# EAGLE design six2two-switch3-interlock (EAGLE 6.4)
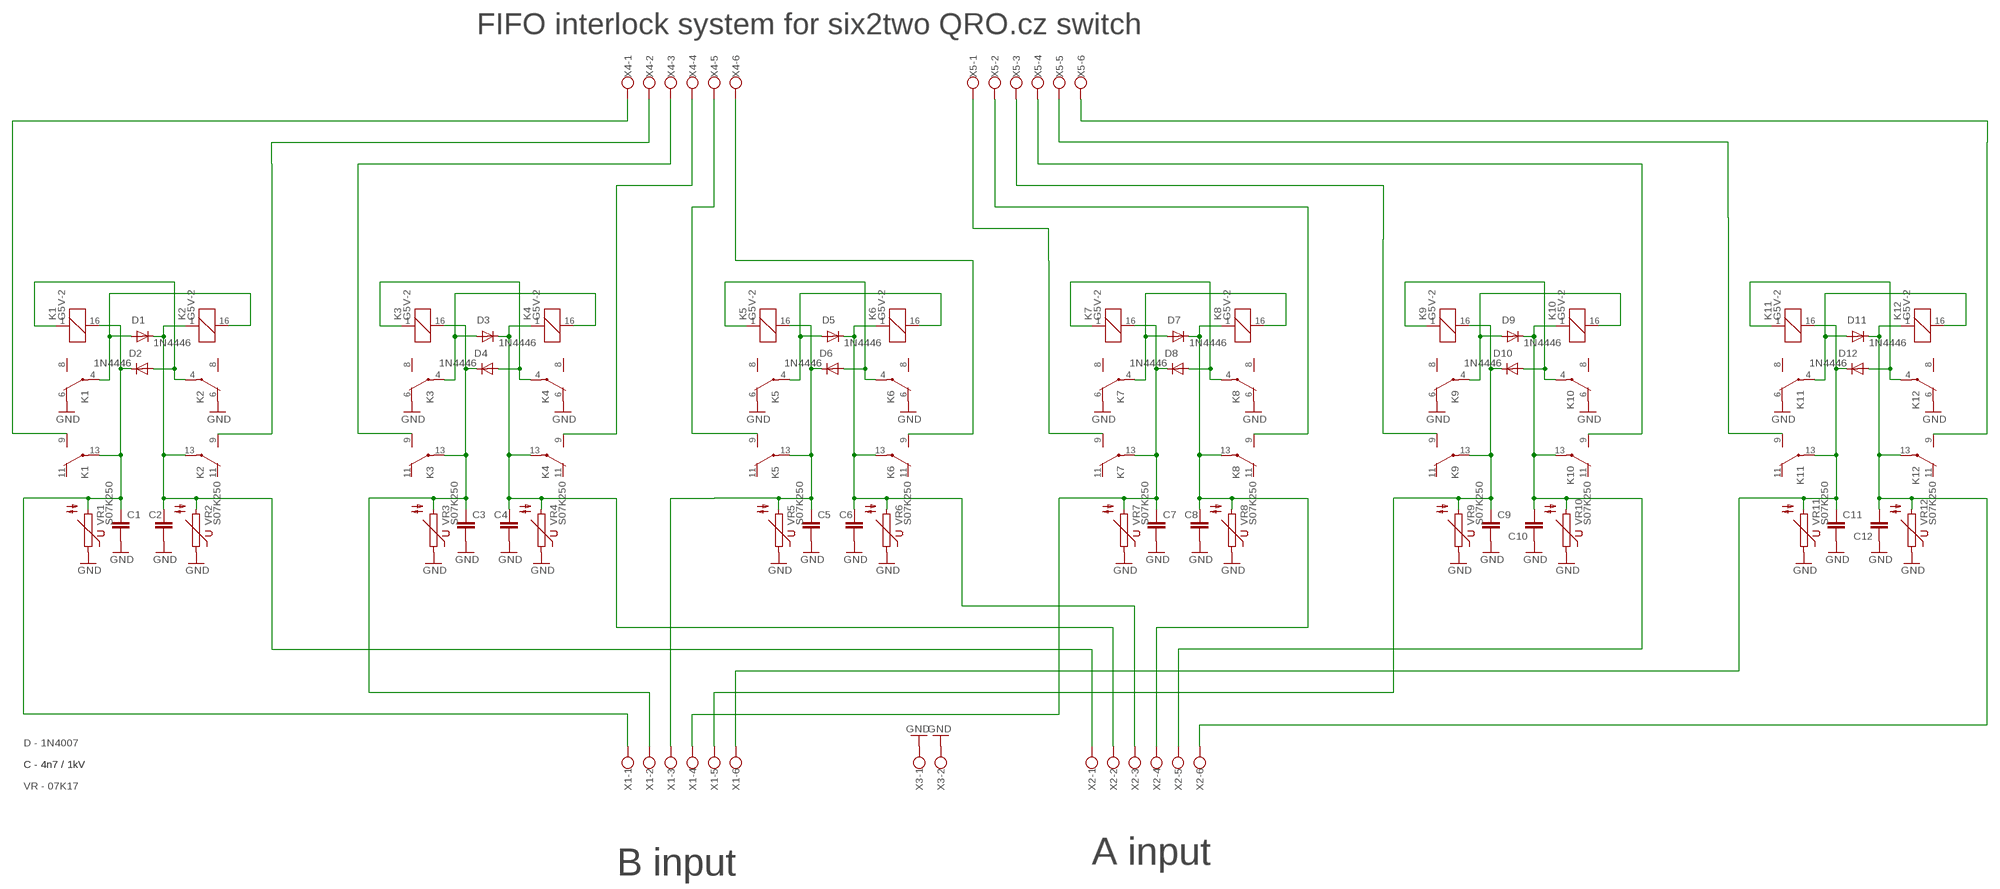
[diagram p0: schematic, sheet 1]

## Parts
C1  C-EU050-024X044  [C050-024X044]
C2  C-EU050-024X044  [C050-024X044]
C3  C-EU050-024X044  [C050-024X044]
C4  C-EU050-024X044  [C050-024X044]
C5  C-EU050-024X044  [C050-024X044]
C6  C-EU050-024X044  [C050-024X044]
C7  C-EU050-024X044  [C050-024X044]
C8  C-EU050-024X044  [C050-024X044]
C9  C-EU050-024X044  [C050-024X044]
C10  C-EU050-024X044  [C050-024X044]
C11  C-EU050-024X044  [C050-024X044]
C12  C-EU050-024X044  [C050-024X044]
D1  1N4446  [DO35-10]
D2  1N4446  [DO35-10]
D3  1N4446  [DO35-10]
D4  1N4446  [DO35-10]
D5  1N4446  [DO35-10]
D6  1N4446  [DO35-10]
D7  1N4446  [DO35-10]
D8  1N4446  [DO35-10]
D9  1N4446  [DO35-10]
D10  1N4446  [DO35-10]
D11  1N4446  [DO35-10]
D12  1N4446  [DO35-10]
K1  G5V-2  [G5V-2]
K2  G5V-2  [G5V-2]
K3  G5V-2  [G5V-2]
K4  G5V-2  [G5V-2]
K5  G5V-2  [G5V-2]
K6  G5V-2  [G5V-2]
K7  G5V-2  [G5V-2]
K8  G5V-2  [G5V-2]
K9  G5V-2  [G5V-2]
K10  G5V-2  [G5V-2]
K11  G5V-2  [G5V-2]
K12  G5V-2  [G5V-2]
VR1  S07K250  [S07K250]
VR2  S07K250  [S07K250]
VR3  S07K250  [S07K250]
VR4  S07K250  [S07K250]
VR5  S07K250  [S07K250]
VR6  S07K250  [S07K250]
VR7  S07K250  [S07K250]
VR8  S07K250  [S07K250]
VR9  S07K250  [S07K250]
VR10  S07K250  [S07K250]
VR11  S07K250  [S07K250]
VR12  S07K250  [S07K250]
X1  W237-136  [W237-136]
X2  W237-136  [W237-136]
X3  W237-102  [W237-102]
X4  W237-136  [W237-136]
X5  W237-136  [W237-136]

## Nets
GND: C1.2 C2.2 C3.2 C4.2 C5.2 C6.2 C7.2 C8.2 C9.2 C10.2 C11.2 C12.2 K1.6(1:O) K2.6(1:O) K3.6(1:O) K4.6(1:O) K5.6(1:O) K6.6(1:O) K7.6(1:O) K8.6(1:O) K9.6(1:O) K10.6(1:O) K11.6(1:O) K12.6(1:O) VR1.1 VR2.1 VR3.1 VR4.1 VR5.1 VR6.1 VR7.1 VR8.1 VR9.1 VR10.1 VR11.1 VR12.1 X3.1 X3.2
N$1: K3.9(2:S) X4.3
N$2: K1.9(2:S) X4.1
N$3: C1.1 D2.C K1.13(2:P) K1.16 VR1.2 X1.1
N$4: C2.1 D1.C K2.1 K2.13(2:P) VR2.2 X2.1
N$5: D1.A K1.4(1:P) K2.16
N$6: D2.A K1.1 K2.4(1:P)
N$7: K2.9(2:S) X4.2
N$8: C3.1 D4.C K3.13(2:P) K3.16 VR3.2 X1.2
N$9: C4.1 D3.C K4.1 K4.13(2:P) VR4.2 X2.2
N$10: D3.A K3.4(1:P) K4.16
N$11: D4.A K3.1 K4.4(1:P)
N$12: K4.9(2:S) X4.4
N$13: K5.9(2:S) X4.5
N$14: C5.1 D6.C K5.13(2:P) K5.16 VR5.2 X1.3
N$15: C6.1 D5.C K6.1 K6.13(2:P) VR6.2 X2.3
N$16: D5.A K5.4(1:P) K6.16
N$17: D6.A K5.1 K6.4(1:P)
N$18: K6.9(2:S) X4.6
N$19: K7.9(2:S) X5.1
N$20: C7.1 D8.C K7.13(2:P) K7.16 VR7.2 X1.4
N$21: C8.1 D7.C K8.1 K8.13(2:P) VR8.2 X2.4
N$22: D7.A K7.4(1:P) K8.16
N$23: D8.A K7.1 K8.4(1:P)
N$24: K8.9(2:S) X5.2
N$25: K9.9(2:S) X5.3
N$26: C9.1 D10.C K9.13(2:P) K9.16 VR9.2 X1.5
N$27: C10.1 D9.C K10.1 K10.13(2:P) VR10.2 X2.5
N$28: D9.A K9.4(1:P) K10.16
N$29: D10.A K9.1 K10.4(1:P)
N$30: K10.9(2:S) X5.4
N$31: K11.9(2:S) X5.5
N$32: C11.1 D12.C K11.13(2:P) K11.16 VR11.2 X1.6
N$33: C12.1 D11.C K12.1 K12.13(2:P) VR12.2 X2.6
N$34: D11.A K11.4(1:P) K12.16
N$35: D12.A K11.1 K12.4(1:P)
N$36: K12.9(2:S) X5.6
Unconnected: K1.8(1:S) K1.11(2:O) K2.8(1:S) K2.11(2:O) K3.8(1:S) K3.11(2:O) K4.8(1:S) K4.11(2:O) K5.8(1:S) K5.11(2:O) K6.8(1:S) K6.11(2:O) K7.8(1:S) K7.11(2:O) K8.8(1:S) K8.11(2:O) K9.8(1:S) K9.11(2:O) K10.8(1:S) K10.11(2:O) K11.8(1:S) K11.11(2:O) K12.8(1:S) K12.11(2:O)

## Notes on the sheet
- FIFO interlock system for six2two QRO.cz switch
- D - 1N4007
- C - 4n7 / 1kV | C - 4n7 / 1kV
- VR - 07K17
- B input | A input

## Library data of the parts
C1-C12 = rcl2:C-EU: CAPACITOR, European symbol
D1-D12 = diode:1N4446: DIODE high speed (Philips)
K1-K12 = relay:G5V-2: OMRON PCB Relay Source: http://www.omron.com/ecb/products/pdf/en-g5v2.pdf; MPN: G5V-2 5DC; OC_FARNELL: 9949488; OC_NEWARK: 78K5703
VR1-VR12 = varistor:S07K250: VARISTOR
X1 X2 X4 X5 = con-wago-500:W237-136: WAGO SCREW CLAMP; MPN: 237-136; OC_FARNELL: unknown; OC_NEWARK: 84K9151
X3 = con-wago-500:W237-102: WAGO SCREW CLAMP; MPN: 237-102; OC_FARNELL: unknown; OC_NEWARK: 70K9898

## Board
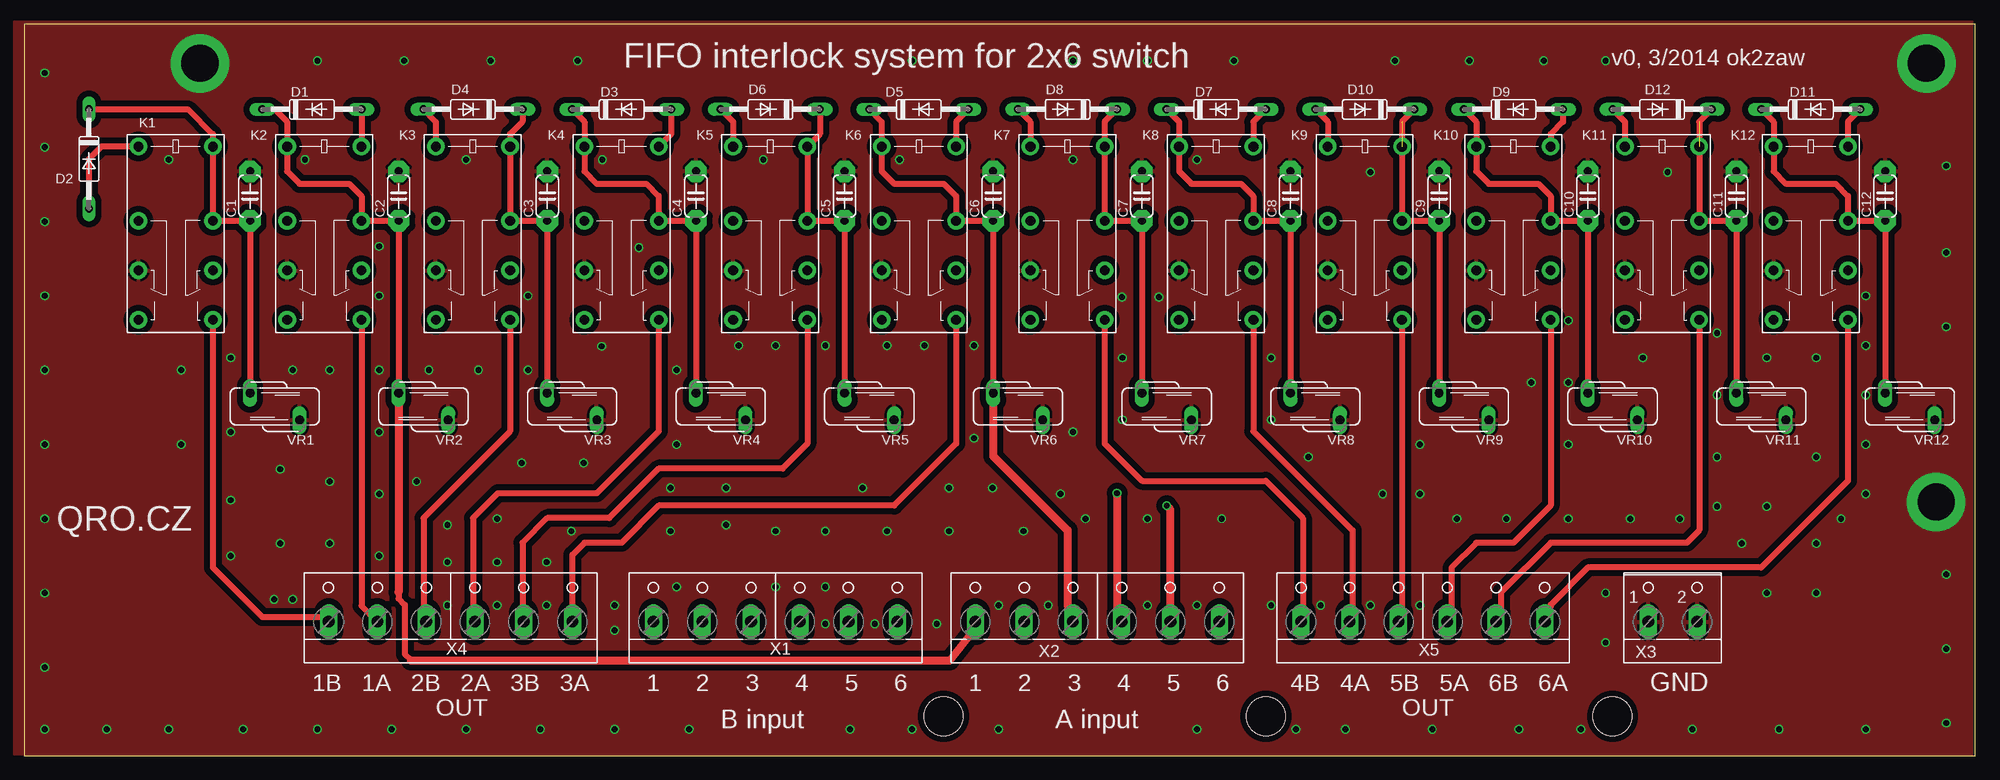
[diagram p1: board, top side]
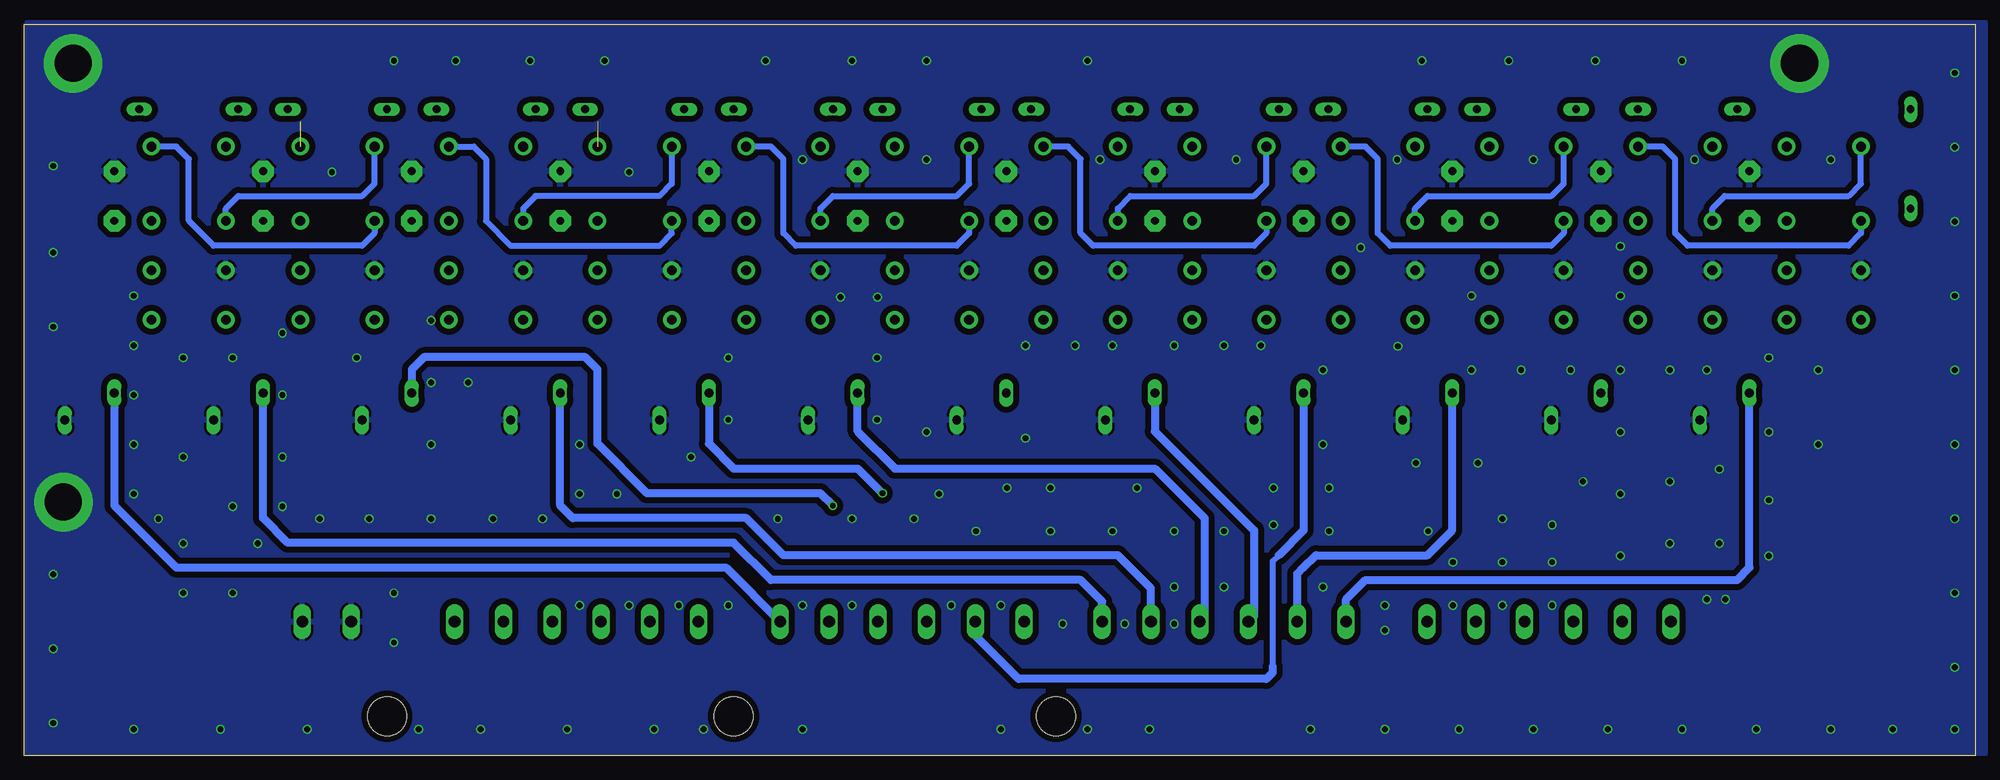
[diagram p2: board, bottom side, seen from below]

Size 200 x 75 mm. Coordinates in mm from the lower left corner, seen from the top.
Outline: 0,0 200,0 200,75 0,75 0,0
Copper layers (1*16): Top 0.035mm / dielectric 1.5mm / Bottom 0.035mm
Design rules "Fusion_eagle_rule_v1.1 *": minimum track width 6mil, minimum drill 12mil, track to track 6mil, track to pad 6mil, pad to pad 6mil, via to via 6mil, smd to smd 0mil, copper to edge 0mil, drill to drill 10mil, minimum pad ring 10mil, minimum via ring 6mil, stop-mask expansion 2mil, vias tented up to drill 100mil, thermal gap 10mil
Holes 4 mm at 94.25,4.05 127.27,4.05 162.83,4.05

### Footprints (pad centres in the part's own frame; a part is rotated, then mirrored left to right if it is on the bottom)
C050-024X044 = drill 0.813 pad 2.184 octagon: 1 -2.54,0; 2 2.54,0
DO35-10 = drill 0.813 long: A 5.08,0; C -5.08,0
G5V-2 = drill 1 pad 1.8: 1 -8.89,-3.81; 4 -1.27,-3.81; 6 3.81,-3.81; 8 8.89,-3.81; 9 8.89,3.81; 11 3.81,3.81; 13 -1.27,3.81; 16 -8.89,3.81
S07K250 = drill 0.914 long: 1 -1.397,-2.54; 2 1.397,2.54
W237-136 = drill 1.194 long: 1 -12.5,-1.27; 2 -7.5,-1.27; 3 -2.5,-1.27; 4 2.5,-1.27; 5 7.5,-1.27; 6 12.5,-1.27
W237-102 = drill 1.194 long: 1 -2.5,-1.27; 2 2.5,-1.27

### Placement (x,y rotation side)
C1  23.13,57.39 90 top
C2  38.37,57.39 90 top
C3  53.61,57.39 90 top
C4  68.85,57.39 90 top
C5  84.09,57.39 90 top
C6  99.33,57.39 90 top
C7  114.57,57.39 90 top
C8  129.81,57.39 90 top
C9  145.05,57.39 90 top
C10  160.29,57.39 90 top
C11  175.53,57.39 90 top
C12  190.77,57.39 90 top
D1  29.48,66.28 0 top
D2  6.62,61.2 270 top
D3  61.23,66.28 0 top
D4  45.99,66.28 180 top
D5  91.71,66.28 0 top
D6  76.47,66.28 180 top
D7  122.19,66.28 0 top
D8  106.95,66.28 180 top
D9  152.67,66.28 0 top
D10  137.43,66.28 180 top
D11  183.15,66.28 0 top
D12  167.91,66.28 180 top
K1  15.51,53.58 270 top
K2  30.75,53.58 270 top
K3  45.99,53.58 270 top
K4  61.23,53.58 270 top
K5  76.47,53.58 270 top
K6  91.71,53.58 270 top
K7  106.95,53.58 270 top
K8  122.19,53.58 270 top
K9  137.43,53.58 270 top
K10  152.67,53.58 270 top
K11  167.91,53.58 270 top
K12  183.15,53.58 270 top
VR1  25.67,35.8 90 top
VR2  40.91,35.8 90 top
VR3  56.15,35.8 90 top
VR4  71.39,35.8 90 top
VR5  86.63,35.8 90 top
VR6  101.87,35.8 90 top
VR7  117.11,35.8 90 top
VR8  132.35,35.8 90 top
VR9  147.59,35.8 90 top
VR10  162.83,35.8 90 top
VR11  178.07,35.8 90 top
VR12  193.31,35.8 90 top
X1  77,15 0 top
X2  110,15 0 top
X3  169,15 0 top
X4  43.69,15 0 top
X5  143.39,15 0 top

### Tracks (layer width: path | path; a pad name or v marks a point on that pad's centre or on a via)
GND  (via drill 0.6, 3.8 pad 6)
  other vias: 18,71 196,26 195,71 51.63,47.15 82.11,42.07 88.46,42.07 92.27,42.07 73.22,42.07 77.03,42.07 159.58,2.7 153.23,2.7 144.34,2.7 135.45,2.7 130.37,2.7 120.21,2.7 99.89,2.7 91,2.7 84.65,2.7 68.14,2.7 60.52,2.7 52.9,2.7 45.28,2.7 37.66,2.7 30.04,2.7 22.42,2.7 14.8,2.7 8.45,2.7 2.1,2.7 2.1,9.05 2.1,16.67 2.1,24.29 2.1,31.91 2.1,39.53 2.1,47.15 2.1,54.77 2.1,62.39 2.1,70.01 16.07,39.53 16.07,31.91 30.04,71.28 38.93,71.28 47.82,71.28 56.71,71.28 91,71.28 107.51,71.28 115.13,71.28 124.02,71.28 140.53,71.28 148.15,71.28 155.77,71.28 162.12,71.28 112.53,47.03 116.34,47.03 63,52.11 197.04,3.34 197.04,10.96 197.04,18.58 197.04,43.98 197.04,51.6 197.04,60.49 59.19,41.98 26.23,21.75 31.31,21.75 31.31,28.1 31.31,39.53 27.5,39.53 26.23,29.37 27.5,16.04 25.59,16.04 21.15,20.48 21.15,26.2 21.15,33.18 21.15,40.8 41.47,39.53 46.55,39.53 40.2,28.1 36.39,20.48 36.39,26.83 36.39,33.18 36.39,39.53 36.39,47.15 36.39,52.23 60.52,15.4 60.52,12.86 53.53,15.4 48.45,15.4 43.37,15.4 66.87,17.31 77.03,17.31 77.03,23.02 71.95,23.66 66.23,23.02 66.23,27.47 71.95,27.47 66.87,31.91 66.87,39.53 53.53,19.85 48.45,19.85 43.37,19.85 43.37,23.66 48.45,24.29 50.99,30.01 57.34,30.01 51.63,39.53 82.11,17.31 82.11,23.02 85.92,27.47 94.81,27.47 99.25,27.47 97.35,32.55 97.35,42.07 93.54,13.5 87.19,13.5 82.11,13.5 171.01,2.7 179.9,2.7 188.79,2.7 122.75,24.29 115.13,24.29 108.78,24.29 106.24,26.83 102.43,23.02 94.81,23.02 88.46,23.02 139.26,26.83 143.07,26.83 143.07,31.91 131.64,30.64 127.83,34.45 127.83,40.8 112.59,40.8 112.59,34.45 107.51,33.18 146.88,24.29 151.96,24.29 154.5,38.26 158.31,38.26 158.31,44.61 158.31,31.91 158.31,24.29 164.66,24.29 169.74,24.29 173.55,25.56 173.55,30.64 173.55,36.99 173.55,43.34 176.09,21.75 183.71,21.75 186.25,24.29 188.79,26.83 188.79,31.91 188.79,36.99 188.79,42.07 178.63,25.56 183.71,30.64 183.71,40.8 178.63,40.8 165.93,40.8 168.47,59.85 137.99,59.85 120.21,61.12 107.51,61.12 89.73,61.12 75.76,61.12 59.25,61.12 45.28,61.12 28.77,61.12 14.8,61.12 127.83,15.4 104.97,15.4 99.89,15.4 115.13,15.4 120.21,15.4 132.91,15.4 137.99,15.4 143.07,15.4 162.12,16.67 162.12,11.59 178.63,16.67 183.71,16.67 188.79,47.15 56.07,23.02
  pour Top (isolate 0.61): -1,75.17 -1,0.24 199.66,0.24 199.66,75.17
  pour Bottom (isolate 0.61): -1,75.17 -1,0.24 199.66,0.24 199.66,75.17
N$1
  Top 0.61: K3.9 49.8,33.26 40.91,24.37 40.91,14.01 X4.3
N$2
  Top 0.61: K1.9 19.32,19.29 24.4,14.21 30.71,14.21 X4.1
N$3
  Top 0.61: D2.C 16.78,66.28 19.32,63.74 K1.16 K1.13 C1.1 VR1.2
  Bottom 0.813: X1.1 64.5,16.02 62.5,18.02 24.4,18.02 23.13,19.29 23.13,37.07 VR1.2
N$4
  Top 0.61: D1.C 25.67,66.28 26.94,65.01 K2.1 26.94,59.93 28.21,58.66 33.29,58.66 34.56,57.39 K2.13 C2.1 VR2.2 | 38.37,16.75 38.37,16.11 39.01,15.48 39.01,10.4 39.64,9.77
  Top 0.813: VR2.2 38.37,16.75 | 39.64,9.77 94.89,9.77 97.42,12.94 97.42,14.29 X2.1
N$5
  Top 0.61: D1.A K2.16
  Bottom 0.61: K1.4 11.7,53.58 12.97,52.31 29.48,52.31 30.75,53.58 30.75,61.2 32.02,62.47 K2.16
N$6
  Top 0.61: K1.1 7.89,62.47 6.62,61.2 D2.A
  Bottom 0.61: K2.4 26.94,56.12 25.67,57.39 12.97,57.39 11.7,58.66 K1.1
N$7
  Top 0.61: K2.9 34.56,15.36 X4.2
N$8
  Top 0.61: D4.C 51.07,65.01 49.8,63.74 K3.16 K3.13 C3.1 VR3.2
  Bottom 0.813: X1.2 69.5,18.64 68.85,19.29 67.58,20.56 56.15,20.56 53.61,23.1 VR3.2
N$9
  Top 0.61: D3.C 57.42,65.01 K4.1 57.42,59.93 58.69,58.66 63.77,58.66 65.04,57.39 K4.13 C4.1 VR4.2
  Bottom 0.61: 71.39,20.56 72.03,19.92 72.03,9.13
  Bottom 0.813: VR4.2 68.85,23.1 71.39,20.56 | 72.03,9.13 72.03,8.5 72.66,7.86 98.06,7.86 102.5,12.3 102.5,13.09 X2.2
N$10
  Top 0.61: D3.A 66.31,63.74 K4.16
  Bottom 0.61: K3.4 42.18,53.58 43.45,52.31 59.96,52.31 61.23,53.58 61.23,61.2 62.5,62.47 K4.16
N$11
  Top 0.61: D4.A 42.18,65.01 K3.1
  Bottom 0.61: K4.4 57.42,56.12 56.15,57.39 43.45,57.39 42.18,58.66 K3.1
N$12
  Top 0.61: K4.9 65.04,33.26 58.69,26.91 48.53,26.91 45.99,24.37 45.99,13.93 X4.4
N$13
  Top 0.61: K5.9 80.28,31.99 77.74,29.45 65.04,29.45 59.96,24.37 53.61,24.37 51.07,21.83 51.07,14.21 51.07,13.85 X4.5
N$14
  Top 0.61: D6.C 81.55,63.74 K5.16 K5.13 C5.1 VR5.2
  Bottom 0.813: VR5.2 84.09,33.26 73.93,23.1 73.93,14.3 X1.3
N$15
  Top 0.61: D5.C 87.9,65.01 K6.1 87.9,59.93 89.17,58.66 94.25,58.66 95.52,57.39 K6.13 C6.1 VR6.2
  Top 0.813: VR6.2 99.33,30.72 106.95,23.1 106.95,15.48 107.58,13.57 107.34,13.57 X2.3
N$16
  Top 0.61: D5.A 95.52,65.01 K6.16
  Bottom 0.61: K5.4 72.66,53.58 73.93,52.31 90.44,52.31 91.71,53.58 91.71,61.2 92.98,62.47 K6.16
N$17
  Top 0.61: D6.A 72.66,65.01 K5.1
  Bottom 0.61: K6.4 87.9,56.12 86.63,57.39 73.93,57.39 72.66,58.66 K5.1
N$18
  Top 0.61: X4.6 56.19,20.6 57.42,21.83 61.23,21.83 65.04,25.64 89.17,25.64 95.52,31.99 K6.9
N$19
  Top 0.61: K7.9 110.76,31.99 114.57,28.18 127.27,28.18 131.08,24.37 131.08,13.92 X5.1
N$20
  Top 0.61: D8.C 110.76,65.01 K7.16 K7.13 C7.1 VR7.2 | VR7.2 114.57,37.07 VR7.2
  Bottom 0.813: X1.4 79.01,14.22 79.01,24.37 84.09,29.45 110.76,29.45 114.57,33.26 VR7.2
N$21  (via drill 0.6)
  Top 0.61: D7.C 118.38,65.01 K8.1 118.38,59.93 119.65,58.66 124.73,58.66 126,57.39 K8.13 C8.1 VR8.2
  Top 0.813: v112.03,26.91 112.03,14.2 X2.4
  Bottom 0.813: VR8.2 129.81,31.99 127.27,29.45 114.57,29.45 v112.03,26.91
N$22
  Top 0.61: D7.A 126,65.01 K8.16
  Bottom 0.61: K7.4 103.14,53.58 104.41,52.31 120.92,52.31 122.19,53.58 122.19,61.2 123.46,62.47 K8.16
N$23
  Top 0.61: D8.A 103.14,65.01 K7.1
  Bottom 0.61: K8.4 118.38,56.12 117.11,57.39 104.41,57.39 103.14,58.66 K7.1
N$24
  Top 0.61: K8.9 126,33.26 132.35,26.91 136.16,23.1 136.16,14 X5.2
N$25
  Top 0.61: K9.9 141.24,14.08 X5.3
N$26  (1 unrouted)
  Top 0.61: D10.C 141.24,65.01 K9.13 C9.1 VR9.2
  Bottom 0.813: X1.5 84.5,17.16 87.9,20.56 122.19,20.56 126,24.37 143.78,24.37 145.05,25.64 VR9.2
N$27  (via drill 0.6)
  Top 0.61: D9.C 148.86,65.01 K10.1 148.86,59.93 150.13,58.66 155.21,58.66 156.48,57.39 K10.13 C10.1 VR10.2
  Top 0.813: X2.5 117.5,25.25 v117.11,25.64
  Bottom 0.813: v117.11,25.64 118.38,26.91 136.16,26.91 141.24,31.99 141.24,39.61 142.51,40.88 159.02,40.88 160.29,39.61 VR10.2
N$28
  Top 0.61: D9.A 157.75,65.01 156.48,63.74 K10.16
  Bottom 0.61: K10.16 153.94,62.47 152.67,61.2 152.67,54.85 150.13,52.31 134.89,52.31 133.62,53.58 K9.4
N$29
  Top 0.61: D10.A 133.62,65.01 K9.1
  Bottom 0.61: K9.1 133.62,58.66 134.89,57.39 147.59,57.39 148.86,56.12 K10.4
N$30
  Top 0.61: K10.9 156.48,25.64 152.67,21.83 148.86,21.83 146.32,19.29 146.32,14.16 X5.4
N$31
  Top 0.61: K11.9 171.72,23.1 170.45,21.83 156.48,21.83 151.4,16.75 151.4,14.24 X5.5
N$32  (1 unrouted)
  Top 0.61: D12.C 171.72,65.01 K11.13 C11.1 VR11.2
  Bottom 0.813: X1.6 89.5,15.81 91.71,18.02 123.46,18.02 127.27,21.83 172.99,21.83 175.53,24.37 VR11.2
N$33
  Top 0.61: D11.C 179.34,65.01 K12.1 179.34,59.93 180.61,58.66 185.69,58.66 186.96,57.39 K12.13 C12.1 VR12.2
  Bottom 0.813: VR12.2 190.77,25.64 184.42,19.29 128.06,19.29 X2.6
N$34
  Top 0.61: D11.A 186.96,65.01 K12.16
  Bottom 0.61: K11.4 164.1,53.58 165.37,52.31 180.61,52.31 183.15,54.85 183.15,61.2 184.42,62.47 K12.16
N$35
  Top 0.61: D12.A 164.1,65.01 K11.1
  Bottom 0.61: K12.4 179.34,56.12 178.07,57.39 165.37,57.39 164.1,58.66 K11.1
N$36
  Top 0.61: K12.9 186.96,28.18 178.07,19.29 160.29,19.29 156.48,15.48 155.84,13.57 155.84,13.77 X5.6

### Text on the board
tNames: FIFO interlock system for 2x6 switch | v0, 3/2014 ok2zaw | QRO.CZ | 1B | 1A | 2B | 2A | 3B | 3A | 1 | 2 | 3 | 4 | 5 | 6 | 1 | 2 | 3 | 4 | 5 | 6 | 4B | 4A | 5B | 5A | 6B | 6A | GND | OUT | OUT | B input | A input
201bmp: /home/ondra/downloads/logo.bmp